# EAGLE schematic control_board_WS2812 (EAGLE 6.3)
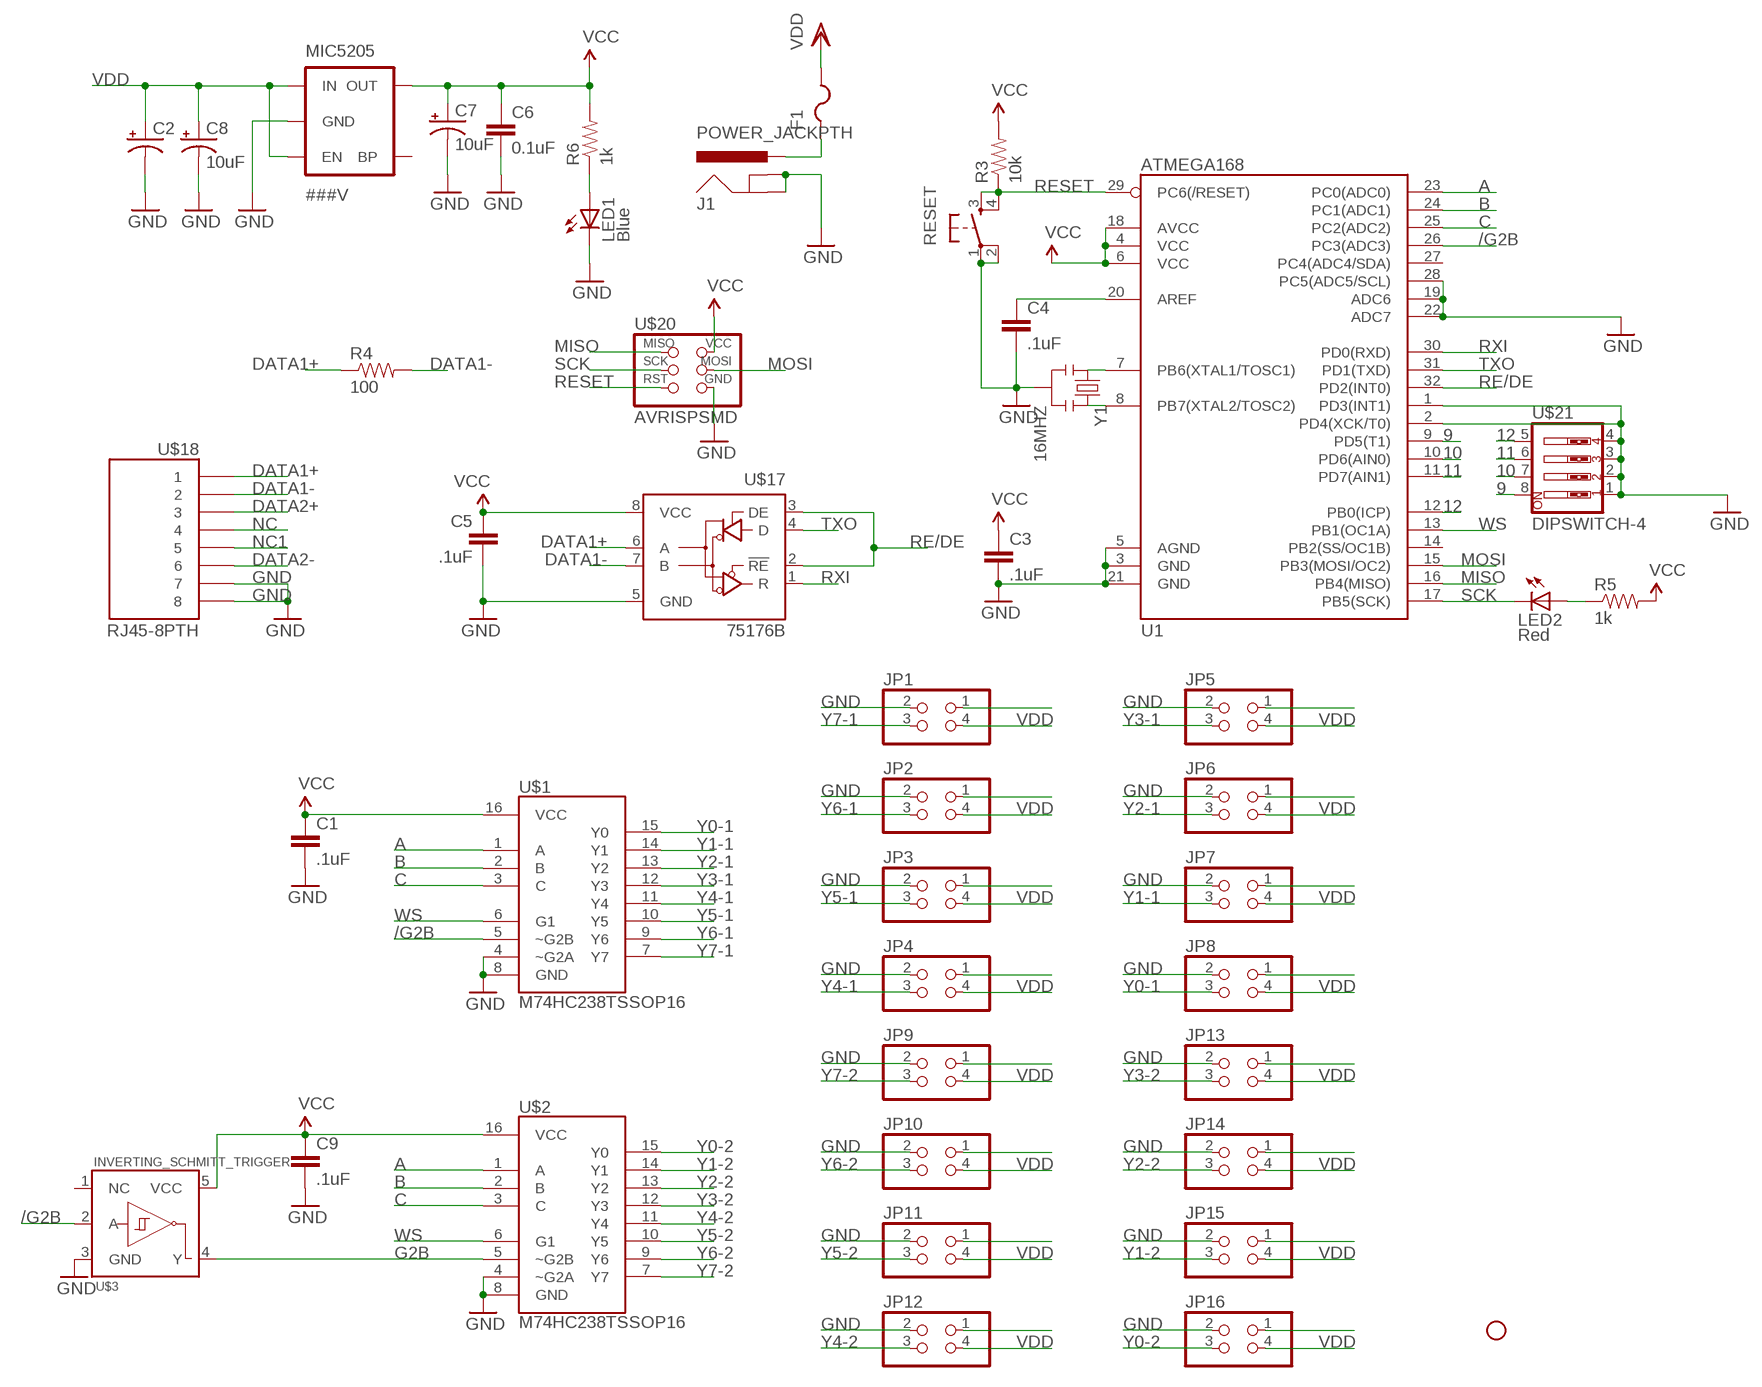
[diagram p0: schematic, sheet 1]

## Parts
C1  .1uF  CAP0402-CAP  [0402-CAP]
C2  CAP_POLC  [PANASONIC_C]
C3  .1uF  CAP0402-CAP  [0402-CAP]
C4  .1uF  CAP0402-CAP  [0402-CAP]
C5  .1uF  CAP0402-CAP  [0402-CAP]
C6  0.1uF  CAP0402-CAP  [0402-CAP]
C7  10uF  CAP_POL1206  [EIA3216]
C8  10uF  CAP_POL1206  [EIA3216]
C9  .1uF  CAP0402-CAP  [0402-CAP]
F1  PTCFUSE-1812  [1812]
J1  POWER_JACKPTH  [POWER_JACK_PTH]
JP1  PINHD-2X2  [2X02]
JP2  PINHD-2X2  [2X02]
JP3  PINHD-2X2  [2X02]
JP4  PINHD-2X2  [2X02]
JP5  PINHD-2X2  [2X02]
JP6  PINHD-2X2  [2X02]
JP7  PINHD-2X2  [2X02]
JP8  PINHD-2X2  [2X02]
JP9  PINHD-2X2  [2X02]
JP10  PINHD-2X2  [2X02]
JP11  PINHD-2X2  [2X02]
JP12  PINHD-2X2  [2X02]
JP13  PINHD-2X2  [2X02]
JP14  PINHD-2X2  [2X02]
JP15  PINHD-2X2  [2X02]
JP16  PINHD-2X2  [2X02]
LED1  Blue  LED0603  [LED-0603]
LED2  Red  LED0603  [LED-0603]
MIC5205  ###V  V_REG_LDOSMD  [SOT23-5]
R3  10k  RESISTOR0402-RES  [0402-RES]
R4  100  RESISTOR1206  [1206]
R5  1k  RESISTOR0402  [C0402]
R6  1k  RESISTOR0402  [C0402]
RESET  TAC_SWITCHSMD  [TACTILE_SWITCH_SMD]
STANDOFF1  STAND-OFF  [STAND-OFF]
U1  ATMEGA168  [TQFP32-08]
U$1  M74HC238TSSOP16  [TSSOP16]
U$2  M74HC238TSSOP16  [TSSOP16]
U$3  INVERTING_SCHMITT_TRIGGER  [TSSOP5]
U$17  75176B  [D_R-PDSO-G8]
U$18  RJ45-8PTH  [RJ45-8]
U$20  AVRISPSMD  [2X03SMD]
U$21  DIPSWITCH-4  [DIPSWITCH-04]
Y1  16MHZ  RESONATOR8MHZ  [RESONATOR-SMD]

## Nets
9: U1.9(PD5(T1)) U$21.8
10: U1.10(PD6(AIN0)) U$21.7
11: U1.11(PD7(AIN1)) U$21.6
12: U1.12(PB0(ICP)) U$21.5
/G2B: U1.26(PC3(ADC3)) U$1.5(~G2B) U$3.2(A)
A: U1.23(PC0(ADC0)) U$1.1(A) U$2.1(A)
B: U1.24(PC1(ADC1)) U$1.2(B) U$2.2(B)
C: U1.25(PC2(ADC2)) U$1.3(C) U$2.3(C)
DATA1+: R4.1 U$17.6(A) U$18.1
DATA1-: R4.2 U$17.7(B) U$18.2
DATA2+: U$18.3
DATA2-: U$18.6
G2B: U$2.5(~G2B) U$3.4(Y)
GND: C1.2 C2.- C3.2 C4.2 C5.2 C6.2 C7.C(-) C8.C(-) C9.2 J1.GND J1.GNDBREAK JP1.2 JP2.2 JP3.2 JP4.2 JP5.2 JP6.2 JP7.2 JP8.2 JP9.2 JP10.2 JP11.2 JP12.2 JP13.2 JP14.2 JP15.2 JP16.2 LED1.C MIC5205.2(GND) RESET.1 RESET.2 U1.1(PD3(INT1)) U1.2(PD4(XCK/T0)) U1.3(GND) U1.5(AGND) U1.19(ADC6) U1.21(GND) U1.22(ADC7) U1.28(PC5(ADC5/SCL)) U$1.4(~G2A) U$1.8(GND) U$2.4(~G2A) U$2.8(GND) U$3.3(GND) U$17.5(GND) U$18.7 U$18.8 U$20.6(GND) U$21.1 U$21.2 U$21.3 U$21.4 Y1.2
MISO: U1.16(PB4(MISO)) U$20.1(MISO)
MOSI: U1.15(PB3(MOSI/OC2)) U$20.4(MOSI)
N$1: JP1.1
N$2: JP2.1
N$3: C4.1 U1.20(AREF)
N$4: U1.7(PB6(XTAL1/TOSC1)) Y1.1
N$5: U1.8(PB7(XTAL2/TOSC2)) Y1.3
N$7: LED2.A R5.1
N$8: F1.1 J1.PWR
N$9: JP3.1
N$14: JP4.1
N$15: JP5.1
N$16: JP6.1
N$17: JP7.1
N$18: JP8.1
N$19: JP9.1
N$20: JP10.1
N$21: JP11.1
N$22: JP12.1
N$23: JP13.1
N$24: JP14.1
N$25: JP15.1
N$26: JP16.1
N$38: LED1.A R6.1
NC: U$18.4
NC1: U$18.5
RE/DE: U1.32(PD2(INT0)) U$17.2(!RE) U$17.3(DE)
RESET: R3.1 RESET.3 RESET.4 U1.29(PC6(/RESET)) U$20.5(RST)
RXI: U1.30(PD0(RXD)) U$17.1(R)
SCK: LED2.C U1.17(PB5(SCK)) U$20.3(SCK)
TXO: U1.31(PD1(TXD)) U$17.4(D)
VCC: C1.1 C3.1 C5.1 C6.1 C7.A(+) C9.1 MIC5205.5(OUT) R3.2 R5.2 R6.2 U1.4(VCC) U1.6(VCC) U1.18(AVCC) U$1.16(VCC) U$2.16(VCC) U$3.5(VCC) U$17.8(VCC) U$20.2(VCC)
VDD: C2.+ C8.A(+) F1.2 JP1.4 JP2.4 JP3.4 JP4.4 JP5.4 JP6.4 JP7.4 JP8.4 JP9.4 JP10.4 JP11.4 JP12.4 JP13.4 JP14.4 JP15.4 JP16.4 MIC5205.1(IN) MIC5205.3(EN)
WS: U1.13(PB1(OC1A)) U$1.6(G1) U$2.6(G1)
Y0-1: JP8.3 U$1.15(Y0)
Y0-2: JP16.3 U$2.15(Y0)
Y1-1: JP7.3 U$1.14(Y1)
Y1-2: JP15.3 U$2.14(Y1)
Y2-1: JP6.3 U$1.13(Y2)
Y2-2: JP14.3 U$2.13(Y2)
Y3-1: JP5.3 U$1.12(Y3)
Y3-2: JP13.3 U$2.12(Y3)
Y4-1: JP4.3 U$1.11(Y4)
Y4-2: JP12.3 U$2.11(Y4)
Y5-1: JP3.3 U$1.10(Y5)
Y5-2: JP11.3 U$2.10(Y5)
Y6-1: JP2.3 U$1.9(Y6)
Y6-2: JP10.3 U$2.9(Y6)
Y7-1: JP1.3 U$1.7(Y7)
Y7-2: JP9.3 U$2.7(Y7)
Unconnected: MIC5205.4(BP) U1.14(PB2(SS/OC1B)) U1.27(PC4(ADC4/SDA)) U$3.1(NC)

## Library data of the parts
C1 C3-C6 C9 = SparkFun-Capacitors:CAP: Capacitor Standard 0603 ceramic capacitor, and 0.1" leaded capacitor.
C2 = SparkFun-Capacitors:CAP_POL: Capacitor Polarized These are standard SMD and PTH capacitors. Normally 10uF, 47uF, and 100uF in electrolytic and tantalum varieties. Always verify the external diameter of the through hole cap, it varies with capacity, voltage, and manufacturer. The EIA devices should be standard.
C7 C8 = SparkFun:CAP_POL: Capacitor Polarized These are standard SMD and PTH capacitors. Normally 10uF, 47uF, and 100uF in electrolytic and tantalum varieties. Always verify the external diameter of the through hole cap, it varies with capacity, voltage, and manufacturer. The EIA devices should be standard.
F1 = adafruit:PTCFUSE: PTC fuses, resettable thermistors
J1 = SparkFun-Connectors:POWER_JACK: Power Jack This is the standard 5.5mm barrel jack for power. The PTH is the most common, proven, reliable, footprint. The Slot footprint only works if the mill layer is transmitted to the PCB fab house so be warned. Spark Fun Electronics SKU : PRT-00119 SMT: CONN-08106 Mating wall wart : TOL-00298 (and others)
JP1-JP16 = pinhead:PINHD-2X2: PIN HEADER
LED1 LED2 = SparkFun:LED: LEDs Standard schematic elements and footprints for 5mm, 3mm, 1206, and 0603 sized LEDs. 5mm - Spark Fun Electronics SKU : COM-00529 (and others)
MIC5205 = SparkFun:V_REG_LDO: Voltage Regulator LDO Standard 150mA LDO voltage regulator in SOT-23 layout. Micrel part MIC5205. BP (by-pass) pin is used to lower output noise with 470pF cap.
R3 R4 = SparkFun-Passives:RESISTOR: Resistor
R5 R6 = SparkFun:RESISTOR: Resistor
RESET = SparkFun-Electromechanical:TAC_SWITCH: Momentary Switch Button commonly used for reset or general input. Spark Fun Electronics SKU : COM-00097 SMT- SWCH-08247; PROD_ID: SWCH-08247
STANDOFF1 = SparkFun-Electromechanical:STAND-OFF: #4 Stand Off This is the mechanical footprint for a #4 phillips button head screw. Use the keepout ring to avoid running the screw head into surrounding components. SKU : PRT-00447
U1 = SparkFun-DigitalIC:ATMEGA168: Atmel 32-pin 8-bit micro, 16k flash.
U$1 U$2 = SparkFun-DigitalIC:M74HC238: M74HC238 - CMOS 3 TO 8 LINE DECODER
U$3 = SparkFun-DigitalIC:INVERTING_SCHMITT_TRIGGER: FAIRCHILD Inverting Schmitt Trigger UNTESTED FOOTPRINT!! Used in External Clock Sources. Digikey P/N NC7SZ14M5XCT-ND
U$17 = 751xx:75176B: 75176B
U$18 = SparkFun-Connectors:RJ45-8: RJ45 Jack Simple RJ45, 8-pin connection - connector for common Cat5, Cat5e, and Cat6 Ethernet cables. Footprint not yet proven in production. Connector sku is PRT-00643; Breakout PCB sku is BOB-00716.
U$20 = fab:AVRISP
U$21 = SparkFun-Electromechanical:DIPSWITCH-4
Y1 = SparkFun-FreqCtrl:RESONATOR: Resonator Small SMD resonator. Used, eg, on the Arduino Pro/ Pro Mini boards. 8MHz- XTAL-08895 16MHz- XTAL-08900; PROD_ID: XTAL-08895; VALUE: 8MHZ

## Net classes
1 vcc: width 0.254 mm